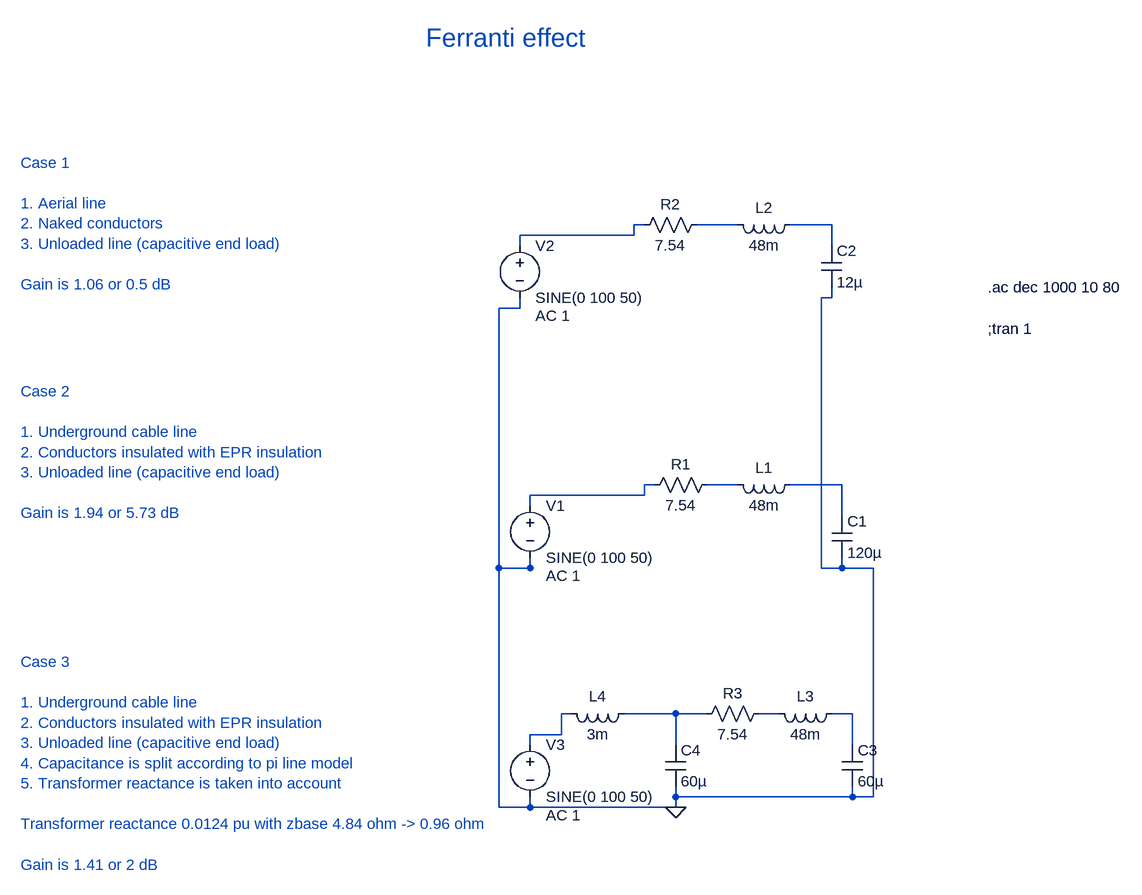
[diagram p0: schematic Ferranti-effect-lines.asc]
Ferranti-effect-lines.asc, the LTspice schematic file:
Version 4.1
SHEET 1 1504 680
WIRE 592 160 592 176
WIRE 576 -256 576 -240
WIRE 608 512 608 528
WIRE 336 512 336 528
WIRE 112 160 112 176
WIRE 96 -240 96 -224
WIRE 112 528 112 544
WIRE 592 176 640 176
WIRE 640 176 640 528
WIRE 640 528 608 528
WIRE 608 528 336 528
WIRE 336 528 336 544
WIRE 336 544 112 544
WIRE 112 544 64 544
WIRE 64 544 64 176
WIRE 64 176 112 176
WIRE 112 176 64 176
WIRE 64 176 64 -224
WIRE 64 -224 96 -224
WIRE 592 176 560 176
WIRE 560 176 560 -240
WIRE 560 -240 576 -240
FLAG 336 544 0
WIRE 288 -352 272 -352
WIRE 96 -320 96 -336
WIRE 272 -352 272 -336
WIRE 272 -336 96 -336
WIRE 432 -352 416 -352
WIRE 368 -352 384 -352
WIRE 416 -352 384 -352
WIRE 576 -320 576 -336
WIRE 512 -352 528 -352
WIRE 576 -336 576 -352
WIRE 576 -352 528 -352
WIRE 304 48 288 48
WIRE 112 80 112 64
WIRE 288 48 288 64
WIRE 288 64 112 64
WIRE 432 48 416 48
WIRE 384 48 400 48
WIRE 416 48 400 48
WIRE 592 96 592 80
WIRE 512 48 528 48
WIRE 592 80 592 48
WIRE 592 48 528 48
WIRE 176 400 160 400
WIRE 112 448 112 432
WIRE 160 400 160 432
WIRE 160 432 112 432
WIRE 336 448 336 432
WIRE 256 400 272 400
WIRE 384 400 368 400
WIRE 336 432 336 400
WIRE 336 400 368 400
WIRE 336 400 272 400
WIRE 496 400 480 400
WIRE 464 400 480 400
WIRE 608 448 608 432
WIRE 576 400 592 400
WIRE 608 432 608 400
WIRE 608 400 592 400
SYMBOL voltage 112 64 R0
WINDOW 123 24 124 Left 2
WINDOW 39 0 0 Left 0
SYMATTR Value2 AC 1
SYMATTR InstName V1
SYMATTR Value SINE(0 100 50)
SYMBOL res 400 32 R90
WINDOW 0 0 56 VBottom 2
WINDOW 3 32 56 VTop 2
SYMATTR InstName R1
SYMATTR Value 7.54
SYMBOL ind 528 32 R90
WINDOW 0 5 56 VBottom 2
WINDOW 3 32 56 VTop 2
SYMATTR InstName L1
SYMATTR Value 48m
SYMBOL cap 576 96 R0
SYMATTR InstName C1
SYMATTR Value 120µ
SYMBOL voltage 96 -336 R0
WINDOW 123 24 124 Left 2
WINDOW 39 0 0 Left 0
SYMATTR Value2 AC 1
SYMATTR InstName V2
SYMATTR Value SINE(0 100 50)
SYMBOL res 384 -368 R90
WINDOW 0 0 56 VBottom 2
WINDOW 3 32 56 VTop 2
SYMATTR InstName R2
SYMATTR Value 7.54
SYMBOL ind 528 -368 R90
WINDOW 0 5 56 VBottom 2
WINDOW 3 32 56 VTop 2
SYMATTR InstName L2
SYMATTR Value 48m
SYMBOL cap 560 -320 R0
SYMATTR InstName C2
SYMATTR Value 12µ
SYMBOL voltage 112 432 R0
WINDOW 123 24 124 Left 2
WINDOW 39 0 0 Left 0
SYMATTR Value2 AC 1
SYMATTR InstName V3
SYMATTR Value SINE(0 100 50)
SYMBOL res 480 384 R90
WINDOW 0 0 56 VBottom 2
WINDOW 3 32 56 VTop 2
SYMATTR InstName R3
SYMATTR Value 7.54
SYMBOL ind 592 384 R90
WINDOW 0 5 56 VBottom 2
WINDOW 3 32 56 VTop 2
SYMATTR InstName L3
SYMATTR Value 48m
SYMBOL cap 592 448 R0
SYMATTR InstName C3
SYMATTR Value 60µ
SYMBOL ind 272 384 R90
WINDOW 0 5 56 VBottom 2
WINDOW 3 32 56 VTop 2
SYMATTR InstName L4
SYMATTR Value 3m
SYMBOL cap 320 448 R0
SYMATTR InstName C4
SYMATTR Value 60µ
TEXT 816 -192 Left 2 !;tran 1
TEXT 816 -256 Left 2 !.ac dec 1000 10 80
TEXT -672 -448 Left 2 ;Case 1\n \n1. Aerial line\n2. Naked conductors\n3. Unloaded line (capacitive end load)\n \nGain is 1.06 or 0.5 dB
TEXT -672 -96 Left 2 ;Case 2\n \n1. Underground cable line\n2. Conductors insulated with EPR insulation\n3. Unloaded line (capacitive end load)\n \nGain is 1.94 or 5.73 dB
TEXT -672 320 Left 2 ;Case 3\n \n1. Underground cable line\n2. Conductors insulated with EPR insulation\n3. Unloaded line (capacitive end load)\n4. Capacitance is split according to pi line model\n5. Transformer reactance is taken into account\n \nTransformer reactance 0.0124 pu with zbase 4.84 ohm -> 0.96 ohm\n \nGain is 1.41 or 2 dB
TEXT -48 -640 Left 4 ;Ferranti effect

The netlist it stands for:
* Ferranti-effect-lines.asc
V1 N004 0 SINE(0 100 50) AC 1
R1 N005 N004 7.54
L1 N006 N005 48m
C1 N006 0 120µ
V2 N001 0 SINE(0 100 50) AC 1
R2 N002 N001 7.54
L2 N003 N002 48m
C2 N003 0 12µ
V3 N007 0 SINE(0 100 50) AC 1
R3 N009 N008 7.54
L3 N010 N009 48m
C3 N010 0 60µ
L4 N008 N007 3m
C4 N008 0 60µ
;tran 1
.ac dec 1000 10 80
* Case 1
* 1. Aerial line
* 2. Naked conductors
* 3. Unloaded line (capacitive end load)
* Gain is 1.06 or 0.5 dB
* Case 2
* 1. Underground cable line
* 2. Conductors insulated with EPR insulation
* 3. Unloaded line (capacitive end load)
* Gain is 1.94 or 5.73 dB
* Case 3
* 1. Underground cable line
* 2. Conductors insulated with EPR insulation
* 3. Unloaded line (capacitive end load)
* 4. Capacitance is split according to pi line model
* 5. Transformer reactance is taken into account
* Transformer reactance 0.0124 pu with zbase 4.84 ohm -> 0.96 ohm
* Gain is 1.41 or 2 dB
* Ferranti effect
.backanno
.end